# EAGLE design ispshield (EAGLE 6.4)
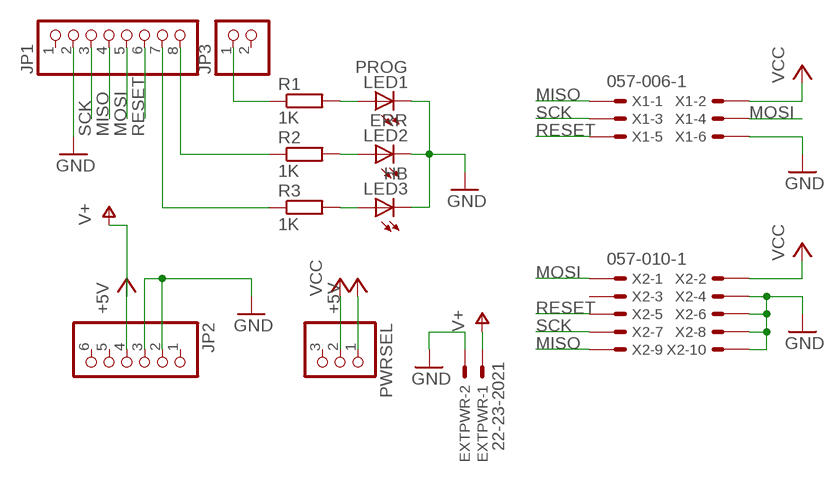
[diagram p0: schematic, sheet 1]

## Parts
EXTPWR  22-23-2021  [22-23-2021]
JP1  PINHD-1X8  [1X08]
JP2  PINHD-1X6  [1X06]
JP3  PINHD-1X2  [1X02]
LED1  PROG  LED3MM  [LED3MM]
LED2  ERR  LED3MM  [LED3MM]
LED3  HB  LED3MM  [LED3MM]
PWRSEL  PINHD-1X3  [1X03]
R1  1K  R-EU_0204/7  [0204/7]
R2  1K  R-EU_0204/7  [0204/7]
R3  1K  R-EU_0204/7  [0204/7]
X1  057-006-1  [057-006-1]
X2  057-010-1  [057-010-1]

## Nets
+5V: PWRSEL.1
ERR: JP1.8 R2.1
GND: EXTPWR.2 JP1.2 JP2.2 JP2.3 LED1.K(C) LED2.K(C) LED3.K(C) X1.6 X2.4 X2.6 X2.8 X2.10
HB: JP1.7 R3.1
MISO: JP1.4 X1.1 X2.9
MOSI: JP1.5 X1.4 X2.1
N$2: LED1.A R1.2
N$3: LED2.A R2.2
N$4: LED3.A R3.2
PMODE: JP3.1 R1.1
RESET: JP1.6 X1.5 X2.5
SCK: JP1.3 X1.3 X2.7
V+: EXTPWR.1 JP2.4 ; supply symbol labelled +5V
VCC: PWRSEL.2 X1.2 X2.2
Unconnected: JP1.1 JP2.1 JP2.5 JP2.6 JP3.2 PWRSEL.3 X2.3

## Library data of the parts
EXTPWR = con-molex:22-23-2021: .100" (2.54mm) Center Header - 2 Pin
JP1 = pinhead:PINHD-1X8: PIN HEADER
JP2 = pinhead:PINHD-1X6: PIN HEADER
JP3 = pinhead:PINHD-1X2: PIN HEADER
LED1-LED3 = led:LED: LED OSRAM: - CHIPLED LG R971, LG N971, LY N971, LG Q971, LY Q971, LO R971, LY R971 LH N974, LH R974 LS Q976, LO Q976, LY Q976 LO Q996 - Hyper CHIPLED LW Q18S LB Q993, LB Q99A, LB R99A - SideLED LS A670, LO A670, LY A670, LG A670, LP A670 LB A673, LV A673, LT A673, LW A673 LH A674 LY A675 LS A676, LA A676, LO A676, LY A676, LW A676 LS A679, LY A679, LG A679 - Hyper Micro SIDELED® LS Y876, LA Y876, LO Y876, LY Y876 LT Y87S - SmartLED LW L88C, LW L88S LB L89C, LB L89S, LG L890 LS L89K, LO L89K, LY L89K LS L896, LA L896, LO L896, LY L896 - TOPLED LS T670, LO T670, LY T670, LG T670, LP T670 LSG T670, LSP T670, LSY T670, LOP T670, LYG T670 LG T671, LOG T671, LSG T671 LB T673, LV T673, LT T673, LW T673 LH T674 LS T676, LA T676, LO T676, LY T676, LB T676, LH T676, LSB T676, LW T676 LB T67C, LV T67C, LT T67C, LS T67K, LO T67K, LY T67K, LW E67C LS E67B, LA E67B, LO E67B, LY E67B, LB E67C, LV E67C, LT E67C LW T67C LS T679, LY T679, LG T679 LS T770, LO T770, LY T770, LG T770, LP T770 LB T773, LV T773, LT T773, LW T773 LH T774 LS E675, LA E675, LY E675, LS T675 LS T776, LA T776, LO T776, LY T776, LB T776 LHGB T686 LT T68C, LB T68C - Hyper Mini TOPLED® LB M676 - Mini TOPLED Santana® LG M470 LS M47K, LO M47K, LY M47K Source: http://www.osram.convergy.de LUXEON: - LUMILED® LXK2-PW12-R00, LXK2-PW12-S00, LXK2-PW14-U00, LXK2-PW14-V00 LXK2-PM12-R00, LXK2-PM12-S00, LXK2-PM14-U00 LXK2-PE12-Q00, LXK2-PE12-R00, LXK2-PE12-S00, LXK2-PE14-T00, LXK2-PE14-U00 LXK2-PB12-K00, LXK2-PB12-L00, LXK2-PB12-M00, LXK2-PB14-N00, LXK2-PB14-P00, LXK2-PB14-Q00 LXK2-PR12-L00, LXK2-PR12-M00, LXK2-PR14-Q00, LXK2-PR14-R00 LXK2-PD12-Q00, LXK2-PD12-R00, LXK2-PD12-S00 LXK2-PH12-R00, LXK2-PH12-S00 LXK2-PL12-P00, LXK2-PL12-Q00, LXK2-PL12-R00 Source: www.luxeon.com KINGBRIGHT: KA-3528ASYC Source: www.kingbright.com
PWRSEL = pinhead:PINHD-1X3: PIN HEADER
R1-R3 = rcl:R-EU_: RESISTOR, European symbol
X1 = con-panduit:057-006-: CONNECTOR 6-pin series 057 contact pc board low profile headers
X2 = con-panduit:057-010-: CONNECTOR 10-pin series 057 contact pc board low profile headers

## Board
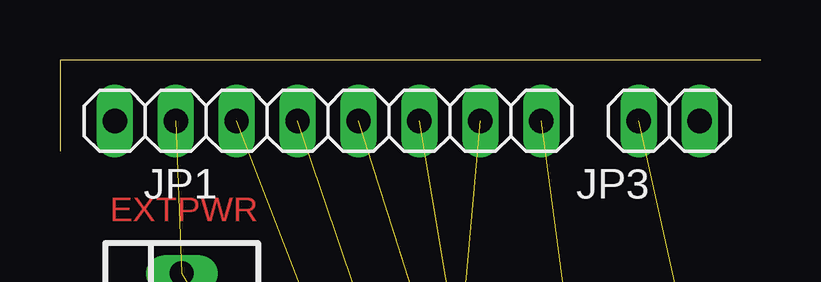
[diagram p1: board, top side]
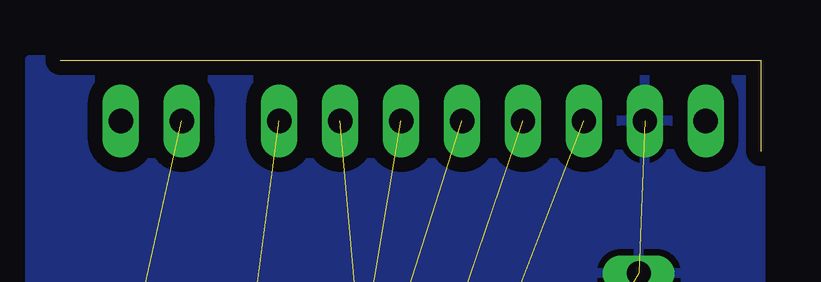
[diagram p2: board, bottom side, seen from below]

Size 29.21 x 3.81 mm. Coordinates in mm from the lower left corner, seen from the top.
Outline: 29.21,3.81 0,3.81 0,0
Copper layers (1*16): Top 0.035mm / dielectric 1.5mm / Bottom 0.035mm
Design rules "default *": minimum track width 10mil, minimum drill 24mil, track to track 8mil, track to pad 8mil, pad to pad 8mil, via to via 8mil, smd to smd 8mil, copper to edge 20mil, drill to drill 8mil, minimum pad ring 10mil, minimum via ring 8mil, stop-mask expansion 4mil, vias tented up to drill 0mil, thermal gap 10mil

### Footprints (pad centres in the part's own frame; a part is rotated, then mirrored left to right if it is on the bottom)
22-23-2021 = drill 1 long: 1 -1.27,0; 2 1.27,0
1X08 = drill 1.016 long: 1 -8.89,0; 2 -6.35,0; 3 -3.81,0; 4 -1.27,0; 5 1.27,0; 6 3.81,0; 7 6.35,0; 8 8.89,0
1X06 = drill 1.016 long: 1 -6.35,0; 2 -3.81,0; 3 -1.27,0; 4 1.27,0; 5 3.81,0; 6 6.35,0
1X02 = drill 1.016 long: 1 -1.27,0; 2 1.27,0
LED3MM = drill 0.813 octagon: A -1.27,0; K 1.27,0
1X03 = drill 1.016 long: 1 -2.54,0; 2 0,0; 3 2.54,0
0204/7 = drill 0.813 octagon: 1 -3.81,0; 2 3.81,0
057-006-1 = drill 1 octagon: 1 -2.54,-1.27; 2 -2.54,1.27; 3 0,-1.27; 4 0,1.27; 5 2.54,-1.27; 6 2.54,1.27
057-010-1 = drill 1 octagon: 1 -5.08,-1.27; 2 -5.08,1.27; 3 -2.54,-1.27; 4 -2.54,1.27; 5 0,-1.27; 6 0,1.27; 7 2.54,-1.27; 8 2.54,1.27; 9 5.08,-1.27; 10 5.08,1.27

### Placement (x,y rotation side)
EXTPWR  5.08,-6.35 90 top  (outside the outline)
JP1  11.18,1.27 0 top
JP2  17.78,-46.99 180 top  (outside the outline)
JP3  25.4,1.27 0 top
LED1  26.67,-22.86 270 top  (outside the outline)
LED2  21.59,-22.86 270 top  (outside the outline)
LED3  16.51,-22.86 270 top  (outside the outline)
PWRSEL  5.08,-13.97 90 top  (outside the outline)
R1  26.67,-13.97 270 top  (outside the outline)
R2  21.59,-13.97 270 top  (outside the outline)
R3  16.51,-13.97 270 top  (outside the outline)
X1  22.86,-35.56 270 top  (outside the outline)
X2  8.89,-33.02 90 top  (outside the outline)

### Tracks (layer width: path | path; a pad name or v marks a point on that pad's centre or on a via)
ERR  (1 unrouted)
GND  (11 unrouted)
  pour Bottom (isolate 0.61): 0,3.81 30.48,3.81 30.48,-49.53 0,-49.53
HB  (1 unrouted)
MISO  (2 unrouted)
MOSI  (2 unrouted)
N$2  (1 unrouted)
N$3  (1 unrouted)
N$4  (1 unrouted)
PMODE  (1 unrouted)
RESET  (2 unrouted)
SCK  (2 unrouted)
V+  (1 unrouted)
VCC  (2 unrouted)

### Text on the board
Top: + | EXT | INT